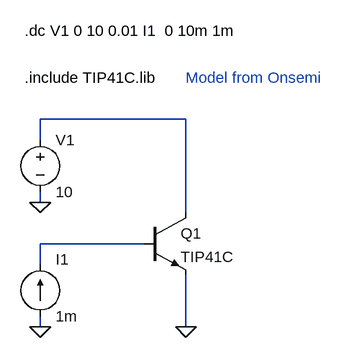
[diagram p0: schematic tip41c_test.asc]
tip41c_test.asc, the LTspice schematic file:
Version 4
SHEET 1 880 680
WIRE 256 -32 32 -32
WIRE 32 0 32 -32
WIRE 32 96 32 80
WIRE 256 112 256 -32
WIRE 192 160 32 160
WIRE 32 192 32 160
WIRE 32 288 32 272
WIRE 256 288 256 208
FLAG 32 288 0
FLAG 256 288 0
FLAG 32 96 0
SYMBOL npn 192 112 R0
SYMATTR InstName Q1
SYMATTR Value TIP41C
SYMBOL voltage 32 -16 R0
SYMATTR InstName V1
SYMATTR Value 10
SYMBOL current 32 272 M180
WINDOW 0 24 88 Left 0
WINDOW 3 24 0 Left 0
SYMATTR InstName I1
SYMATTR Value 1m
TEXT 8 -96 Left 0 !.include TIP41C.lib
TEXT 8 -168 Left 0 !.dc V1 0 10 0.01 I1  0 10m 1m
TEXT 256 -96 Left 0 ;Model from Onsemi

The netlist it stands for:
* tip41c_test.asc
Q1 N001 N002 0 0 TIP41C
V1 N001 0 10
I1 0 N002 1m
.model NPN NPN
.model PNP PNP
.lib standard.bjt
.include TIP41C.lib
.dc V1 0 10 0.01 I1  0 10m 1m
* Model from Onsemi
.backanno
.end